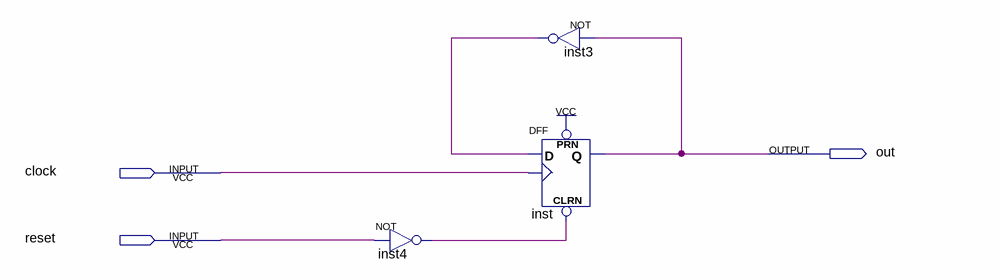
[diagram p0: schematic sheet]
// Quartus schematic divFrequencia_1.bdf as structural Verilog: 3 symbols, 3 pins
module divFrequencia_1 (
  input  clock,
  input  reset,
  output out
);

  wire inst3_out, inst4_out;

  not inst4 (inst4_out, reset);
  not inst3 (inst3_out, out);
  DFF inst (.CLRN(inst4_out), .CLK(clock), .D(inst3_out), .PRN(1'b1), .Q(out));
endmodule
